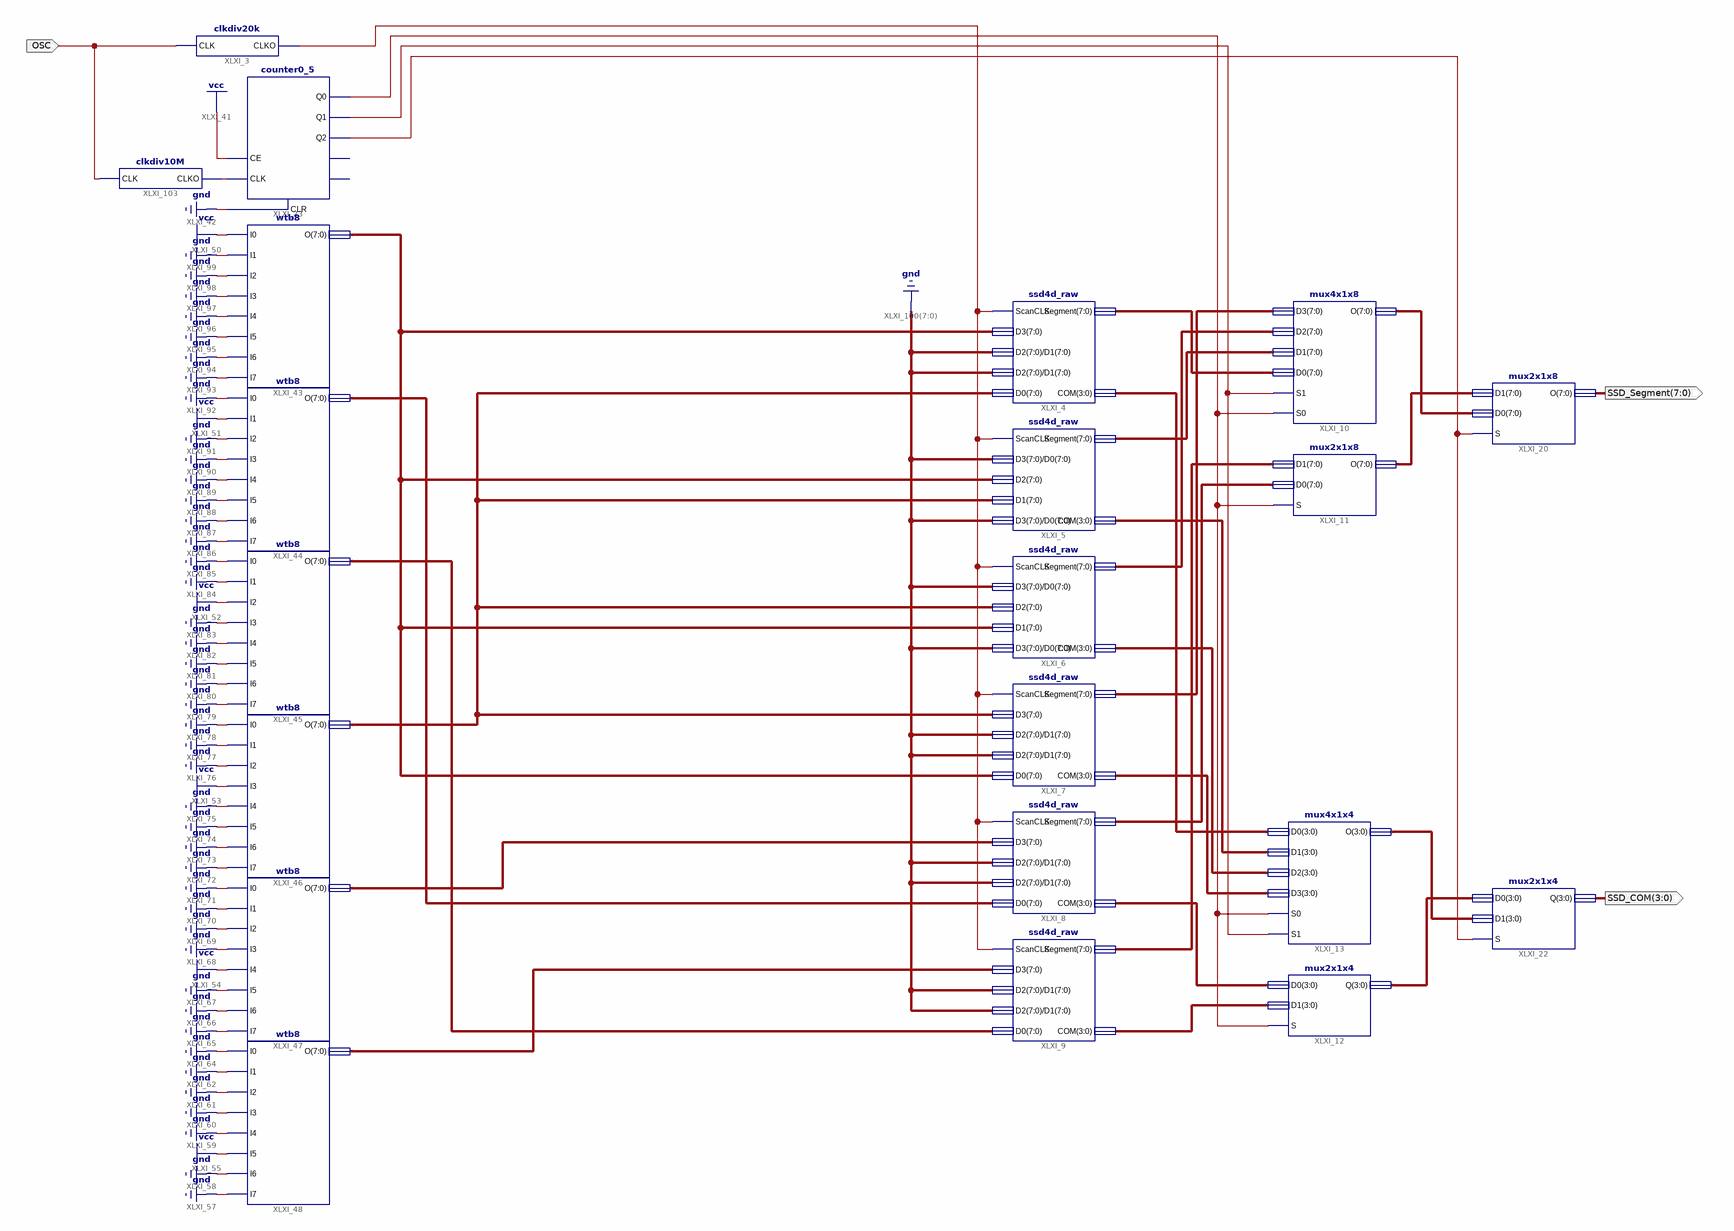
[diagram p0: schematic sheet 1]
// Xilinx ISE schematic main.sch (spartan6) as structural Verilog: 21 symbols, 3 ports
module main (
  input  OSC,
  output [3:0] SSD_COM,
  output [7:0] SSD_Segment
);

  wire XLXN_29, XLXN_68, XLXN_70, XLXN_71, XLXN_91;
  wire [3:0] XLXN_27, XLXN_28, XLXN_83, XLXN_84, XLXN_85, XLXN_86, XLXN_87, XLXN_88;
  wire [7:0] XLXN_25, XLXN_26, XLXN_77, XLXN_78, XLXN_79, XLXN_80, XLXN_81, XLXN_82, XLXN_152, XLXN_153,
       XLXN_154, XLXN_155, XLXN_156, XLXN_159;

  ssd4d_raw XLXI_4 (
    .ScanCLK(XLXN_91), .D3(XLXN_159), .D2({8{1'b0}}), .D1({8{1'b0}}), .D0(XLXN_154), .Segment(XLXN_77),
    .COM(XLXN_88));
  ssd4d_raw XLXI_5 (
    .ScanCLK(XLXN_91), .D3({8{1'b0}}), .D2(XLXN_159), .D1(XLXN_154), .D0({8{1'b0}}), .Segment(XLXN_78),
    .COM(XLXN_87));
  ssd4d_raw XLXI_6 (
    .ScanCLK(XLXN_91), .D3({8{1'b0}}), .D2(XLXN_154), .D1(XLXN_159), .D0({8{1'b0}}), .Segment(XLXN_79),
    .COM(XLXN_86));
  ssd4d_raw XLXI_7 (
    .ScanCLK(XLXN_91), .D3(XLXN_154), .D2({8{1'b0}}), .D1({8{1'b0}}), .D0(XLXN_159), .Segment(XLXN_80),
    .COM(XLXN_85));
  ssd4d_raw XLXI_8 (
    .ScanCLK(XLXN_91), .D3(XLXN_155), .D2({8{1'b0}}), .D1({8{1'b0}}), .D0(XLXN_152), .Segment(XLXN_81),
    .COM(XLXN_84));
  ssd4d_raw XLXI_9 (
    .ScanCLK(XLXN_91), .D3(XLXN_156), .D2({8{1'b0}}), .D1({8{1'b0}}), .D0(XLXN_153), .Segment(XLXN_82),
    .COM(XLXN_83));
  mux4x1x8 XLXI_10 (.D3(XLXN_80), .D2(XLXN_79), .D1(XLXN_78), .D0(XLXN_77), .S1(XLXN_71), .S0(XLXN_70), .O(XLXN_25));
  mux2x1x8 XLXI_11 (.D1(XLXN_82), .D0(XLXN_81), .S(XLXN_70), .O(XLXN_26));
  mux2x1x4 XLXI_12 (.D0(XLXN_84), .D1(XLXN_83), .S(XLXN_70), .Q(XLXN_28));
  mux4x1x4 XLXI_13 (.D0(XLXN_88), .D1(XLXN_87), .D2(XLXN_86), .D3(XLXN_85), .S0(XLXN_70), .S1(XLXN_71), .O(XLXN_27));
  mux2x1x8 XLXI_20 (.D1(XLXN_26), .D0(XLXN_25), .S(XLXN_68), .O(SSD_Segment));
  mux2x1x4 XLXI_22 (.D0(XLXN_28), .D1(XLXN_27), .S(XLXN_68), .Q(SSD_COM));
  clkdiv20k XLXI_3 (.CLK(OSC), .CLKO(XLXN_91));
  counter0_5 XLXI_23 (.CE(1'b1), .CLK(XLXN_29), .CLR(1'b0), .Q0(XLXN_70), .Q1(XLXN_71), .Q2(XLXN_68));  // open: CEO, TC
  wtb8 XLXI_43 (.I0(1'b1), .I1(1'b0), .I2(1'b0), .I3(1'b0), .I4(1'b0), .I5(1'b0), .I6(1'b0), .I7(1'b0), .O(XLXN_159));
  wtb8 XLXI_44 (.I0(1'b0), .I1(1'b1), .I2(1'b0), .I3(1'b0), .I4(1'b0), .I5(1'b0), .I6(1'b0), .I7(1'b0), .O(XLXN_152));
  wtb8 XLXI_45 (.I0(1'b0), .I1(1'b0), .I2(1'b1), .I3(1'b0), .I4(1'b0), .I5(1'b0), .I6(1'b0), .I7(1'b0), .O(XLXN_153));
  wtb8 XLXI_46 (.I0(1'b0), .I1(1'b0), .I2(1'b0), .I3(1'b1), .I4(1'b0), .I5(1'b0), .I6(1'b0), .I7(1'b0), .O(XLXN_154));
  wtb8 XLXI_47 (.I0(1'b0), .I1(1'b0), .I2(1'b0), .I3(1'b0), .I4(1'b1), .I5(1'b0), .I6(1'b0), .I7(1'b0), .O(XLXN_155));
  wtb8 XLXI_48 (.I0(1'b0), .I1(1'b0), .I2(1'b0), .I3(1'b0), .I4(1'b0), .I5(1'b1), .I6(1'b0), .I7(1'b0), .O(XLXN_156));
  clkdiv10M XLXI_103 (.CLK(OSC), .CLKO(XLXN_29));
endmodule
